# EAGLE design KombyPi (EAGLE 7.2.0)
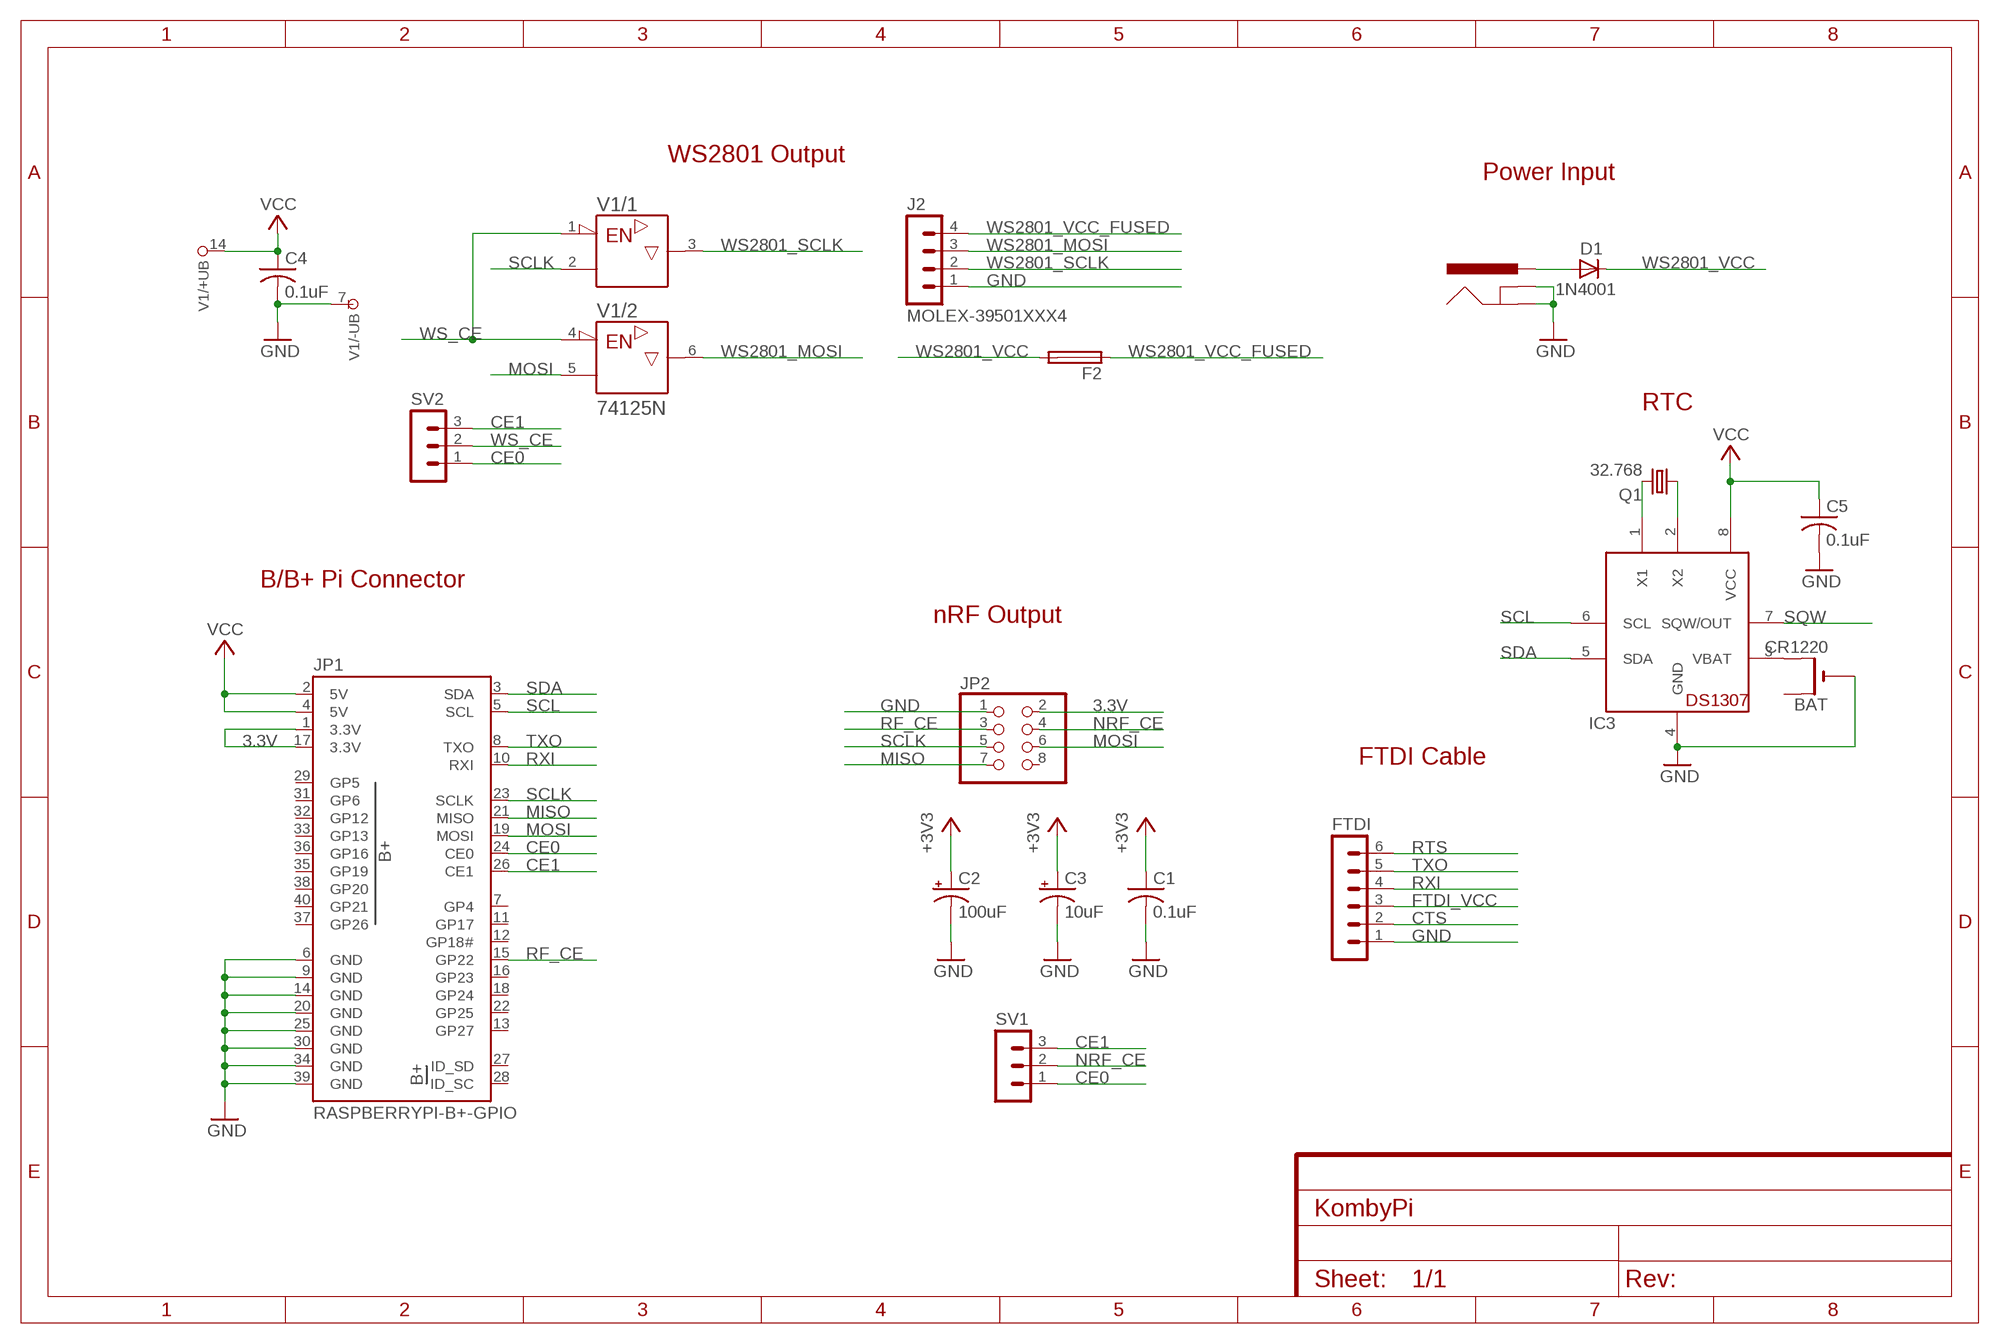
[diagram p0: schematic, sheet 1]

## Parts
BAT  CR1220  CR1220THM  [CR1220-THM]
C1  0.1uF  C-US025-025X050  [C025-025X050]
C2  100uF  CAP_POLPTH1  [CPOL-RADIAL-100UF-25V]
C3  10uF  CAP_POLPTH2  [CPOL-RADIAL-10UF-25V]
C4  0.1uF  C-US025-025X050  [C025-025X050]
C5  0.1uF  C-US025-025X050  [C025-025X050]
D1  1N4001  DIODEPTH  [DIODE-0.4]
F2  FUSE_MCCQ_122  [MCCQ_122]
FTDI  MA06-1  [MA06-1]
IC3  DS1307  [DIL08]
J1  POWER_JACKPTH  [POWER_JACK_PTH]
J2  MOLEX-39501XXX4  [39501XXX4]
JP1  RASPBERRYPI-B+-GPIO  [2X20-SHROUDED]
JP2  NRF_HEADER  [2X04]
Q1  32.768  CRYTALTC38H  [TC38H]
SV1  MA03-1  [MA03-1]
SV2  MA03-1  [MA03-1]
V1  74125N  [DIL14]

## Nets
3.3V [RFBoard]: C2.1(+) C3.1(+) JP1.1(3.3V) JP1.17(3.3V) JP2.2(VCC) ; supply symbol labelled +3V3
+3V3: C1.1
CE0: JP1.24(CE0) SV1.1 SV2.1
CE1 [RFBoard]: JP1.26(CE1) SV1.3 SV2.3
CTS: FTDI.2
FTDI_VCC: FTDI.3
GND: BAT.- C1.2 C2.2(-) C3.2(-) C4.2 C5.2 FTDI.1 IC3.4(GND) J1.GND J1.GNDBREAK J2.1 JP1.6(GND) JP1.9(GND) JP1.14(GND) JP1.20(GND) JP1.25(GND) JP1.30(GND) JP1.34(GND) JP1.39(GND) JP2.1(GND) V1.7(/-UB:-UB)
MISO [RFBoard]: JP1.21(MISO) JP2.7(MISO)
MOSI [RFBoard]: JP1.19(MOSI) JP2.6(MOSI) V1.5(/2:A)
N$3: D1.A J1.PWR
N$14: IC3.1(X1) Q1.2
N$15: IC3.2(X2) Q1.1
N$39: BAT.+2(+1) IC3.3(VBAT)
NRF_CE [RFBoard]: JP2.4(CSN) SV1.2
RF_CE [RFBoard]: JP1.15(GP22) JP2.3(CE)
RTS: FTDI.6
RXI: FTDI.4 JP1.10(RXI)
SCL: IC3.6(SCL) JP1.5(SCL)
SCLK: JP1.23(SCLK) JP2.5(SCK) V1.2(/1:A)
SDA: IC3.5(SDA) JP1.3(SDA)
SQW: IC3.7(SQW/OUT)
TXO: FTDI.5 JP1.8(TXO)
VCC: C4.1 C5.1 IC3.8(VCC) JP1.2(5V) JP1.4(5V) V1.14(/+UB:+UB)
WS2801_MOSI: J2.3 V1.6(/2:Y)
WS2801_SCLK: J2.2 V1.3(/1:Y)
WS2801_VCC: D1.C F2.P$3 F2.P$4
WS2801_VCC_FUSED: F2.P$1 F2.P$2 J2.4
WS_CE: SV2.2 V1.1(/1:!G) V1.4(/2:!G)
Unconnected: BAT.+1(+) JP1.7(GP4) JP1.11(GP17) JP1.12(GP18#) JP1.13(GP27) JP1.16(GP23) JP1.18(GP24) JP1.22(GP25) JP1.27(ID_SD) JP1.28(ID_SC) JP1.29(GP5) JP1.31(GP6) JP1.32(GP12) JP1.33(GP13) JP1.35(GP19) JP1.36(GP16) JP1.37(GP26) JP1.38(GP20) JP1.40(GP21) JP2.8(IRQ) V1.8(/3:Y) V1.9(/3:A) V1.10(/3:!G) V1.11(/4:Y) V1.12(/4:A) V1.13(/4:!G)

## Notes on the sheet
- WS2801 Output
- Power Input
- RTC
- B/B+ Pi Connector
- nRF Output
- FTDI Cable

## Library data of the parts
BAT = adafruit:CR1220: CR1216/CR1220/CR1225 12mm 3V lithium coin cell Great for battery packup. Both SMT and THM holders. Note the THM package has the ground pads on both sides of the PCB so that the masks are the same - this reduces the cost
C1 C4 C5 = adafruit:C-US: CAPACITOR, American symbol
C2 C3 = SparkFun:CAP_POL: Capacitor Polarized These are standard SMD and PTH capacitors. Normally 10uF, 47uF, and 100uF in electrolytic and tantalum varieties. Always verify the external diameter of the through hole cap, it varies with capacity, voltage, and manufacturer. The EIA devices should be standard.
D1 = SparkFun:DIODE: Diode These are standard reverse protection diodes and small signal diodes. SMA package can handle up to about 1A. SOD-323 can handle about 200mA. What the SOD-323 package when ordering, there are some mfgs out there that are 5-pin packages.
F2 = fuse_rg:FUSE
FTDI = Materdaddy-Custom:MA06-1: PIN HEADER; OC_FARNELL: unknown; OC_NEWARK: unknown
IC3 = adafruit:DS1307: DS1307 Real time clock (RTC) with battery backup ability. Talk to it via i2c
J1 = SparkFun:POWER_JACK: Power Jack This is the standard 5.5mm barrel jack for power. The PTH is the most common, proven, reliable, footprint. All others are experimental. The Slot footprint only works if the mill layer is transmitted to the PCB fab house so be warned. Spark Fun Electronics SKU : PRT-00119. Mating wall wart : TOL-00298 (and others)
J2 = molex-3950x:MOLEX-39501XXX4
JP1 = SparkFun-Boards:RASPBERRYPI-B+-GPIO: Raspberry Pi B+ GPIO Header 2x20 pin connector
JP2 = Materdaddy-Custom:NRF_HEADER: PIN HEADER
Q1 = crystal:CRYTAL: CRYSTAL
SV1 SV2 = Materdaddy-Custom:MA03-1: PIN HEADER; OC_FARNELL: unknown; OC_NEWARK: unknown
V1 = 74ttl-din:74*125: Quad bus BUFFER, 3-state

## Net classes
1 RFBoard: width 0.406 mm

## Board
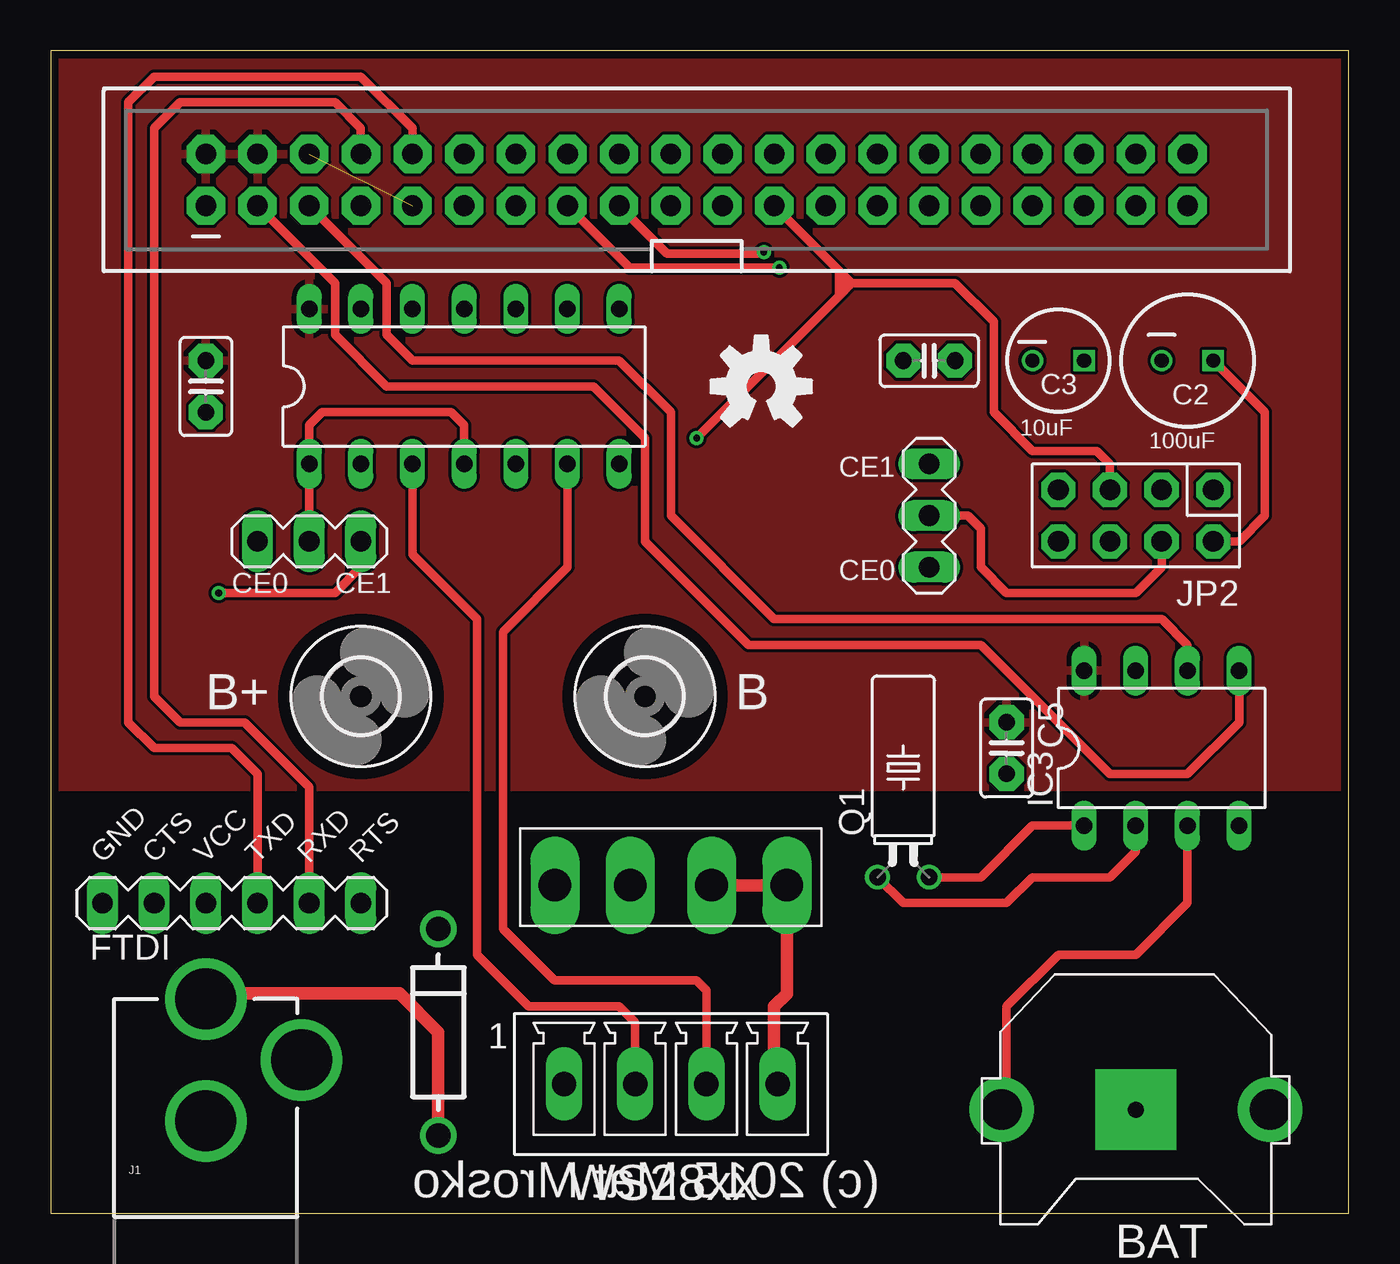
[diagram p1: board, top side]
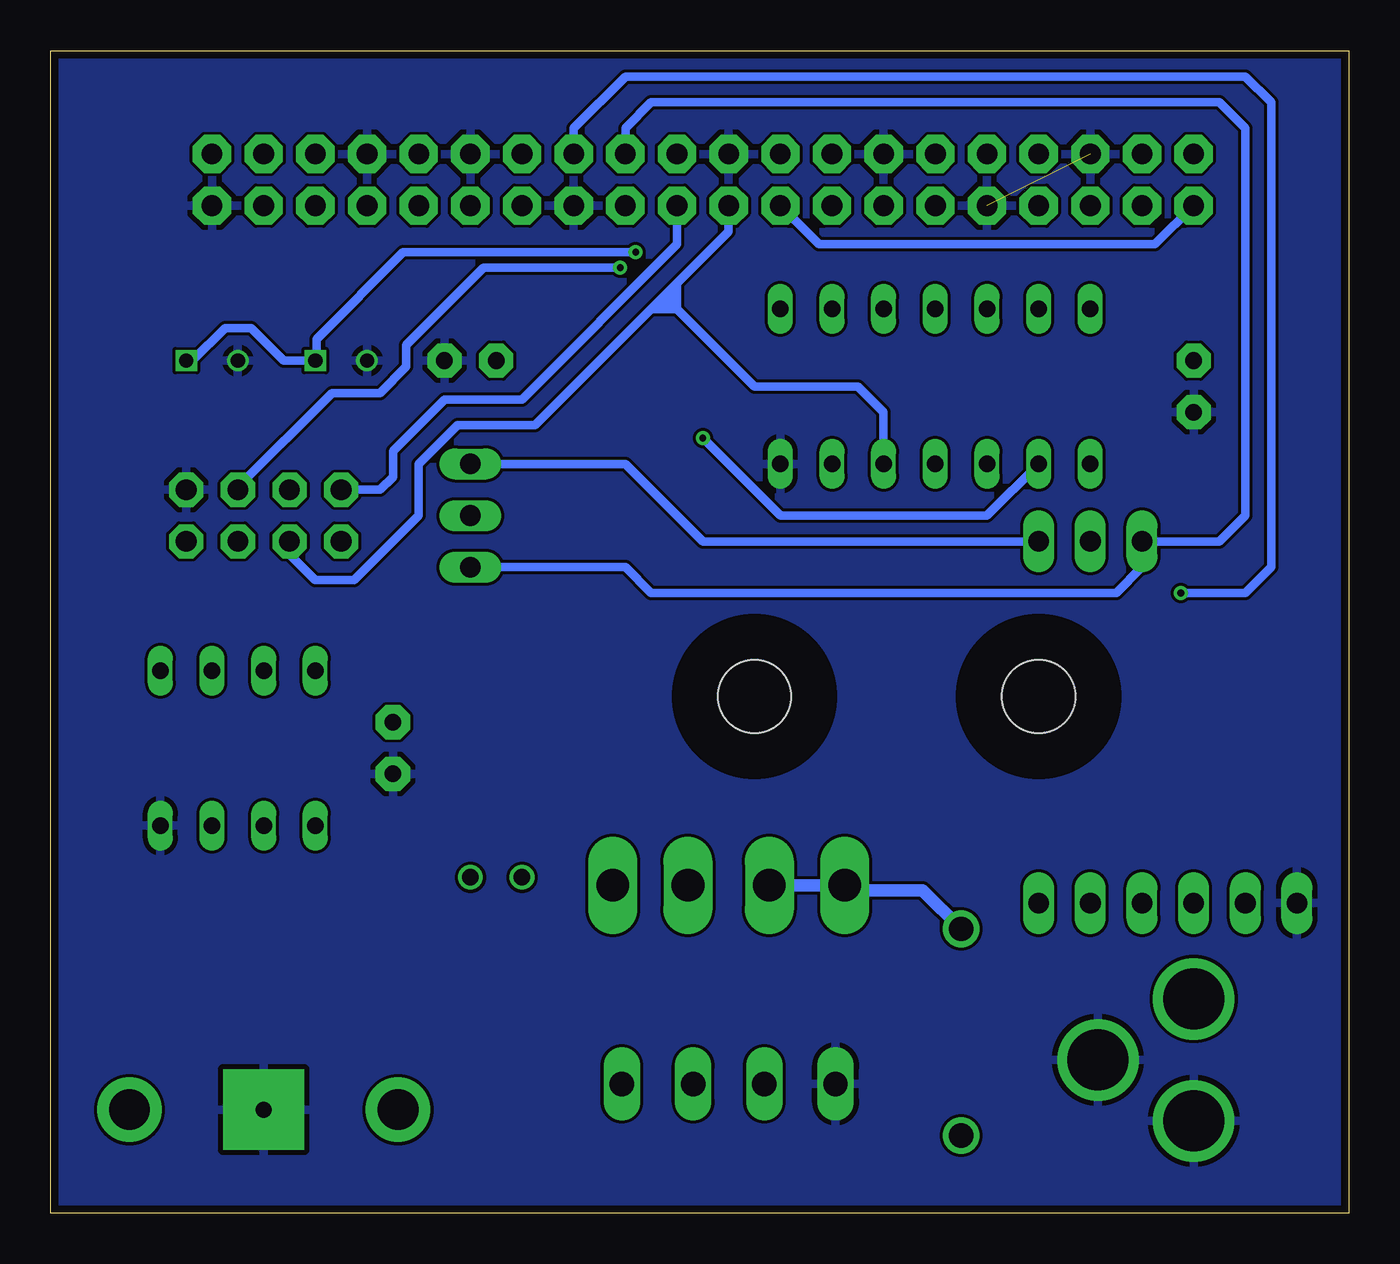
[diagram p2: board, bottom side, seen from below]

Size 63.8 x 57.14 mm. Coordinates in mm from the lower left corner, seen from the top.
Outline: 0,0 63.8,0 63.8,57.14 0,57.14 0,0
Copper layers (1*16): Top 0.0356mm / dielectric 1.5011mm / Bottom 0.0356mm
Design rules "oshpark": minimum track width 6mil, minimum drill 13mil, track to track 6mil, track to pad 6mil, pad to pad 6mil, via to via 6mil, smd to smd 6mil, copper to edge 15mil, drill to drill 6mil, minimum pad ring 7mil, minimum via ring 7mil, stop-mask expansion 4mil, vias tented up to drill 0mil, thermal gap 10mil

### Footprints (pad centres in the part's own frame; a part is rotated, then mirrored left to right if it is on the bottom)
CR1220-THM = drill 2 pad 3.175: +1 -6.604,0; +2 6.604,0 | drill 0.8 pad 3.962 square: - 0,0
C025-025X050 = drill 0.813 pad 1.676 octagon: 1 -1.27,0; 2 1.27,0
CPOL-RADIAL-100UF-25V = drill 0.7 square: 1 1.27,0 | drill 0.7: 2 -1.27,0
CPOL-RADIAL-10UF-25V = drill 0.7 square: 1 1.27,0 | drill 0.7: 2 -1.27,0
DIODE-0.4 = drill 1.2: A 0,0; C 10.16,0
MCCQ_122 = drill 1.6 pad 2.184 long: P$1 -5.7,0.4; P$2 -2,0.4; P$3 2,0.4; P$4 5.7,0.4
MA06-1 = drill 1.016 long: 1 -6.35,0; 2 -3.81,0; 3 -1.27,0; 4 1.27,0; 5 3.81,0; 6 6.35,0
DIL08 = drill 0.813 long: 1 -3.81,-3.81; 2 -1.27,-3.81; 3 1.27,-3.81; 4 3.81,-3.81; 5 3.81,3.81; 6 1.27,3.81; 7 -1.27,3.81; 8 -3.81,3.81
POWER_JACK_PTH = drill 2.997: GND 0,7.7; GNDBREAK 4.7,10.7; PWR 0,13.7
39501XXX4 = drill 1.2 long: 1 -5.25,0; 2 -1.75,0; 3 1.75,0; 4 5.25,0
2X20-SHROUDED = drill 1.016 pad 1.88 octagon: 1 -1.27,24.13; 2 1.27,24.13; 3 -1.27,21.59; 4 1.27,21.59; 5 -1.27,19.05; 6 1.27,19.05; 7 -1.27,16.51; 8 1.27,16.51; 9 -1.27,13.97; 10 1.27,13.97; 11 -1.27,11.43; 12 1.27,11.43; 13 -1.27,8.89; 14 1.27,8.89; 15 -1.27,6.35; 16 1.27,6.35; 17 -1.27,3.81; 18 1.27,3.81; 19 -1.27,1.27; 20 1.27,1.27; 21 -1.27,-1.27; 22 1.27,-1.27; 23 -1.27,-3.81; 24 1.27,-3.81; 25 -1.27,-6.35; 26 1.27,-6.35; 27 -1.27,-8.89; 28 1.27,-8.89; 29 -1.27,-11.43; 30 1.27,-11.43; 31 -1.27,-13.97; 32 1.27,-13.97; 33 -1.27,-16.51; 34 1.27,-16.51; 35 -1.27,-19.05; 36 1.27,-19.05; 37 -1.27,-21.59; 38 1.27,-21.59; 39 -1.27,-24.13; 40 1.27,-24.13
2X04 = drill 1.016 pad 1.676 octagon: 1 -3.81,-1.27; 2 -3.81,1.27; 3 -1.27,-1.27; 4 -1.27,1.27; 5 1.27,-1.27; 6 1.27,1.27; 7 3.81,-1.27; 8 3.81,1.27
TC38H = drill 0.813: 1 -1.27,0; 2 1.27,0
MA03-1 = drill 1.016 long: 1 -2.54,0; 2 0,0; 3 2.54,0
3,6 = hole 3.6: 0,0
DIL14 = drill 0.813 long: 1 -7.62,-3.81; 2 -5.08,-3.81; 3 -2.54,-3.81; 4 0,-3.81; 5 2.54,-3.81; 6 5.08,-3.81; 7 7.62,-3.81; 8 7.62,3.81; 9 5.08,3.81; 10 2.54,3.81; 11 0,3.81; 12 -2.54,3.81; 13 -5.08,3.81; 14 -7.62,3.81

### Placement (x,y rotation side)
BAT  53.34,5.08 180 top
C1  43.18,41.91 0 top
C2  55.88,41.91 0 top
C3  49.53,41.91 0 top
C4  7.62,40.64 270 top
C5  46.99,22.86 270 top
D1  19.05,3.81 90 top
F2  30.48,16.51 180 top
FTDI  8.89,15.24 0 top
IC3  54.61,22.86 0 top
J1  7.62,-3.17 0 top
J2  30.48,6.35 0 top
JP1  31.75,50.8 90 top
JP2  53.34,34.29 180 top
Q1  41.91,16.51 0 top
SV1  43.18,34.29 90 top
SV2  12.7,33.02 0 top
U$1  [3,6]  29.21,25.4 0 top
U$2  [3,6]  15.24,25.4 0 top
U$3  [OSHW-LOGO-M]  34.92,40.64 0 top
V1  20.32,40.64 0 top

### Tracks (layer width: path | path; a pad name or v marks a point on that pad's centre or on a via)
3.3V  (via drill 0.33)
  Top 0.406: JP2.2 58.42,33.02 59.69,34.29 59.69,39.37 C2.1 | v35.05,47.24 34.98,47.17 30.3,47.17 JP1.17
  Bottom 0.406: C2.1 56.84,41.91 55.24,43.51 53.95,43.51 52.35,41.91 C3.1 50.75,42.06 50.75,42.98 46.48,47.24 v35.05,47.24 | JP1.1 9.53,47.62 26.04,47.62 JP1.17
CE0
  Bottom 0.406: SV1.1 35.56,31.75 34.29,30.48 11.43,30.48 10.16,31.75 SV2.1 6.35,33.02 5.08,34.29 5.08,53.34 6.35,54.61 34.29,54.61 35.56,53.34 JP1.24
CE1  (via drill 0.33)
  Top 0.406: v8.26,30.48 13.97,30.48 15.24,31.75 SV2.3
  Bottom 0.406: SV2.3 31.75,33.02 35.56,36.83 SV1.3 | JP1.26 38.1,53.34 35.56,55.88 5.08,55.88 3.81,54.61 3.81,31.75 5.08,30.48 v8.26,30.48
GND  (1 unrouted)
  pour Bottom: 0,57.15 0,0 64.14,0 64.14,57.15
MISO
  Bottom 0.406: JP1.21 33.02,47.62 40.64,40.01 44.45,40.01 46.99,37.47 46.99,36.2 47.62,35.56 JP2.7
MOSI
  Bottom 0.406: JP2.6 52.07,32.38 50.8,31.11 48.9,31.11 45.72,34.29 45.72,36.83 43.81,38.73 40.01,38.73 33.66,45.09 | 33.66,45.09 30.48,48.26 JP1.19 | V1.5 22.86,39.37 24.13,40.64 29.21,40.64 33.66,45.09 | 33.66,45.09 33.66,44.45 | 33.66,44.45 34.29,44.45 | 33.66,44.45 33.02,44.45 33.02,45.09 | 33.02,45.72 33.02,45.09 | 33.02,45.09 33.66,45.09
N$3
  Top 0.61: D1.A 19.05,8.89 17.14,10.79 7.89,10.79 J1.PWR
N$14
  Top 0.406: IC3.1 48.26,19.05 45.72,16.51 Q1.2
N$15
  Top 0.406: IC3.2 53.34,17.78 52.07,16.51 48.26,16.51 46.99,15.24 41.91,15.24 Q1.1
N$39
  Top 0.406: IC3.3 55.88,15.24 53.34,12.7 49.53,12.7 46.99,10.16 46.99,5.33 BAT.+2
NRF_CE
  Top 0.406: SV1.2 45.09,34.29 45.72,33.66 45.72,31.75 46.99,30.48 53.34,30.48 54.61,31.75 JP2.4
RF_CE  (via drill 0.33)
  Top 0.406: v35.81,46.48 28.45,46.48 JP1.15
  Bottom 0.406: v35.81,46.48 42.52,46.48 46.33,42.67 46.33,41.6 47.62,40.31 49.99,40.31 54.56,35.74 54.56,35.59 JP2.3
RXI
  Top 0.406: FTDI.4 10.16,21.59 8.89,22.86 5.08,22.86 3.81,24.13 3.81,54.61 5.08,55.88 15.24,55.88 17.78,53.34 JP1.10
SCL
  Top 0.406: JP1.5 16.51,45.72 16.51,43.18 17.78,41.91 27.94,41.91 30.48,39.37 30.48,34.29 35.56,29.21 54.61,29.21 55.88,27.94 IC3.6
SCLK  (via drill 0.33)
  Top 0.406: JP1.23 39.37,45.72 | 39.37,45.72 44.45,45.72 46.35,43.81 46.35,39.37 48.26,37.47 51.44,37.47 52.07,36.83 JP2.5 | v31.75,38.1 38.73,45.09 | 38.73,46.35 38.73,45.72 | 39.37,45.72 38.73,45.09 | 38.73,45.09 38.73,45.72 | 38.73,45.72 39.37,45.72
  Bottom 0.406: V1.2 17.78,34.29 27.94,34.29 v31.75,38.1
SDA
  Top 0.406: IC3.5 58.42,24.13 55.88,21.59 52.07,21.59 45.72,27.94 34.29,27.94 29.21,33.02 29.21,38.1 26.67,40.64 16.51,40.64 13.97,43.18 13.97,45.72 JP1.3
TXO
  Top 0.406: FTDI.5 12.7,20.95 9.53,24.13 6.35,24.13 5.08,25.4 5.08,53.34 6.35,54.61 13.97,54.61 15.24,53.34 JP1.8
VCC
  pour Top: 0,57.15 0,20.95 64.14,20.95 64.14,57.15
WS2801_MOSI
  Top 0.406: J2.3 32.23,10.95 31.75,11.43 24.77,11.43 22.23,13.97 22.23,28.57 25.4,31.75 V1.6
WS2801_SCLK
  Top 0.406: J2.2 28.73,9.37 27.94,10.16 23.5,10.16 20.95,12.7 20.95,29.21 17.78,32.38 V1.3
WS2801_VCC
  Bottom 0.61: F2.P$3 F2.P$4 24.55,15.88 20.95,15.88 D1.C
WS2801_VCC_FUSED
  Top 0.61: J2.4 35.56,6.52 35.56,10.16 36.18,10.78 F2.P$1 F2.P$2
WS_CE
  Top 0.406: V1.4 20.32,38.73 19.68,39.37 13.34,39.37 12.7,38.73 V1.1 SV2.2

### Text on the board
tNames: CE1 | CE0 | CE0 | CE1 | B+ | B | GND | CTS | VCC | TXD | RXD | RTS | (c) 2015 Mat Mrosko | WS28xx